# EAGLE design vcnl36687s-breakout (EAGLE 9.6.2)
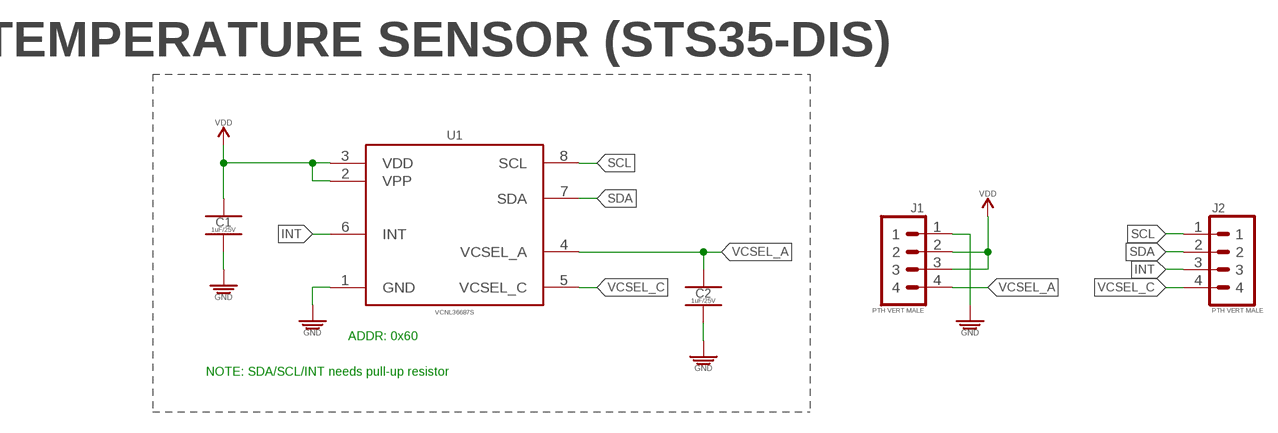
[diagram p0: schematic, sheet 1]

## Parts
C1  1uF/25V  1UF_CER_SMD-0402_25V-10%  [CAPC1005X55_SMD-0402]
C2  1uF/25V  1UF_CER_SMD-0402_25V-10%  [CAPC1005X55_SMD-0402]
J1  PTH VERT MALE  1X04_PTH_VERT_MALE_2.54MM  [HDRV4W64P254_1X4_1016X254X838B]
J2  PTH VERT MALE  1X04_PTH_VERT_MALE_2.54MM  [HDRV4W64P254_1X4_1016X254X838B]
U1  VCNL36687S  [SON77P200X305X100-8N]

## Nets
GND: C1.2 C2.2 J1.1 U1.1(GND)
INT: J2.3 U1.6(INT)
SCL: J2.1 U1.8(SCL)
SDA: J2.2 U1.7(SDA)
VCSEL_A: C2.1 J1.4 U1.4(VCSEL_A)
VCSEL_C: J2.4 U1.5(VCSEL_C)
VDD: C1.1 J1.2 J1.3 U1.2(VPP) U1.3(VDD)

## Notes on the sheet
- TEMPERATURE SENSOR (STS35-DIS)
- ADDR: 0x60
- NOTE: SDA/SCL/INT needs pull-up resistor

## Library data of the parts
C1 C2 = _capacitors:1UF; DATASHEET: https://product.tdk.com/info/en/catalog/datasheets/mlcc_commercial_lowprofile_en.pdf; DIST: Digikey; DISTLINK: https://www.digikey.com/products/en?keywords=445-13185-1-ND; DISTPN: 445-13185-1-ND; MFR: TDK Corporation; MPN: CGB2A1X5R1E105K033BC
J1 J2 = _connectors:1X04; DATASHEET: https://drawings-pdf.s3.amazonaws.com/C10436.pdf; DIST: Digikey; DISTLINK: https://www.digikey.com/products/en?keywords=PEC04SAAN; DISTPN: S1012E-04-ND; MFR: Sullins Connector Solutions; MPN: PEC04SAAN
U1 = _sensors:VCNL36687S: SENSOR OPT AMBIENT MODULE Optical Sensor Ambient I²C 8-SMD Module; DATASHEET: https://www.vishay.com/docs/84907/vcnl36687s.pdf; DIST: Digikey; DISTLINK: https://www.digikey.com/en/products/detail/vishay-semiconductor-opto-division/VCNL36687S/9647134?s=N4IgTCBcDaIGoGEByAZAzANgwDgOwGUEAVAWiQBEQBdAXyA; DISTPN: VCNL36687SCT-ND; MFR: Vishay Semiconductor Opto Division; MPN: VCNL36687S

## Board
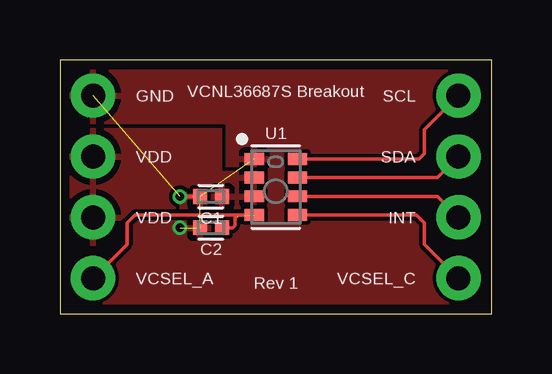
[diagram p1: board, top side]
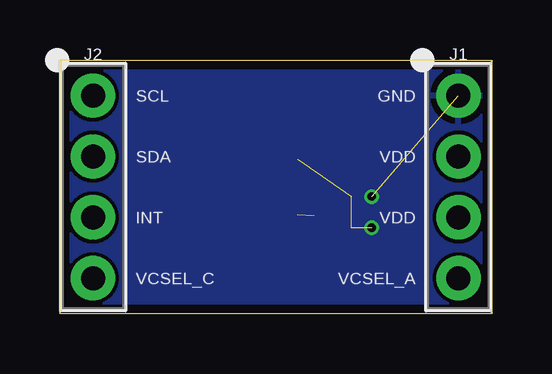
[diagram p2: board, bottom side, seen from below]

Size 18 x 10.6 mm. Coordinates in mm from the lower left corner, seen from the top.
Outline: 0,0 18,0 18,10.6 0,10.6 0,0
Copper layers (1*16): Top 0.035559375mm / dielectric 1.6mm / Bottom 0.035559375mm
Design rules "oshpark-2layer": minimum track width 6mil, minimum drill 10mil, track to track 6mil, track to pad 6mil, pad to pad 6mil, via to via 6mil, smd to smd 6mil, copper to edge 15mil, drill to drill 6mil, minimum pad ring 5mil, minimum via ring 5mil, stop-mask expansion 2.5mil, vias tented up to drill 0mil, thermal gap 10mil

### Footprints (pad centres in the part's own frame; a part is rotated, then mirrored left to right if it is on the bottom)
CAPC1005X55_SMD-0402 = smd 0.585 x 0.612: 1 -0.458,0; 2 0.458,0
HDRV4W64P254_1X4_1016X254X838B = drill 1 pad 1.85: 1 -3.81,0; 2 -1.27,0; 3 1.27,0; 4 3.81,0
SON77P200X305X100-8N = smd 0.8 x 0.495: 1 -0.9,1.163; 2 -0.9,0.388; 3 -0.9,-0.388; 4 -0.9,-1.163; 5 0.9,-1.163; 6 0.9,-0.388; 7 0.9,0.388; 8 0.9,1.163

### Placement (x,y rotation side)
C1  6.3,4.9 180 top
C2  6.3,3.6 180 top
J1  1.38,5.3 270 bottom
J2  16.62,5.3 270 bottom
U1  9,5.3 0 top

### Tracks (layer width: path | path; a pad name or v marks a point on that pad's centre or on a via)
GND  (via drill 0.35)  (4 unrouted)
  Top 0.152: v5,4.9 C1.2
  other vias: 5,3.6
  pour Bottom (rank 6): 0,0 18,0 18,10.6 0,10.6
  pour Top (rank 5): 0,0 18,0 18,10.6 0,10.6
INT
  Top 0.152: U1.6 15.74,4.91 J2.3
SCL
  Top 0.152: U1.8 14.96,6.46 15.2,6.7 15.2,7.69 J2.1
SDA
  Top 0.152: U1.7 15.74,5.69 J2.2
VCSEL_A  (1 unrouted)
  Top 0.152: U1.4 3.14,4.14 2.8,3.8 2.8,2.91 J1.4 | C2.1 7.2,3.6 7.3,3.7 7.3,3.8 7.3,4 7.4,4.1
VCSEL_C
  Top 0.152: U1.5 14.86,4.14 15.2,3.8 15.2,2.91 J2.4
VDD
  pour Top: 0,7.7 0,2.9 2.8,2.9 2.8,4.2 8.4,4.2 8.4,5.9 6.7,5.9 6.7,7.7

### Text on the board
tPlace: GND | VCNL36687S Breakout | SCL | VDD | SDA | VDD | INT | VCSEL_A | Rev 1 | VCSEL_C
bPlace: GND | SCL | VDD | SDA | VDD | INT | VCSEL_A | VCSEL_C